# EAGLE design MainBoard (EAGLE 9.0.1)
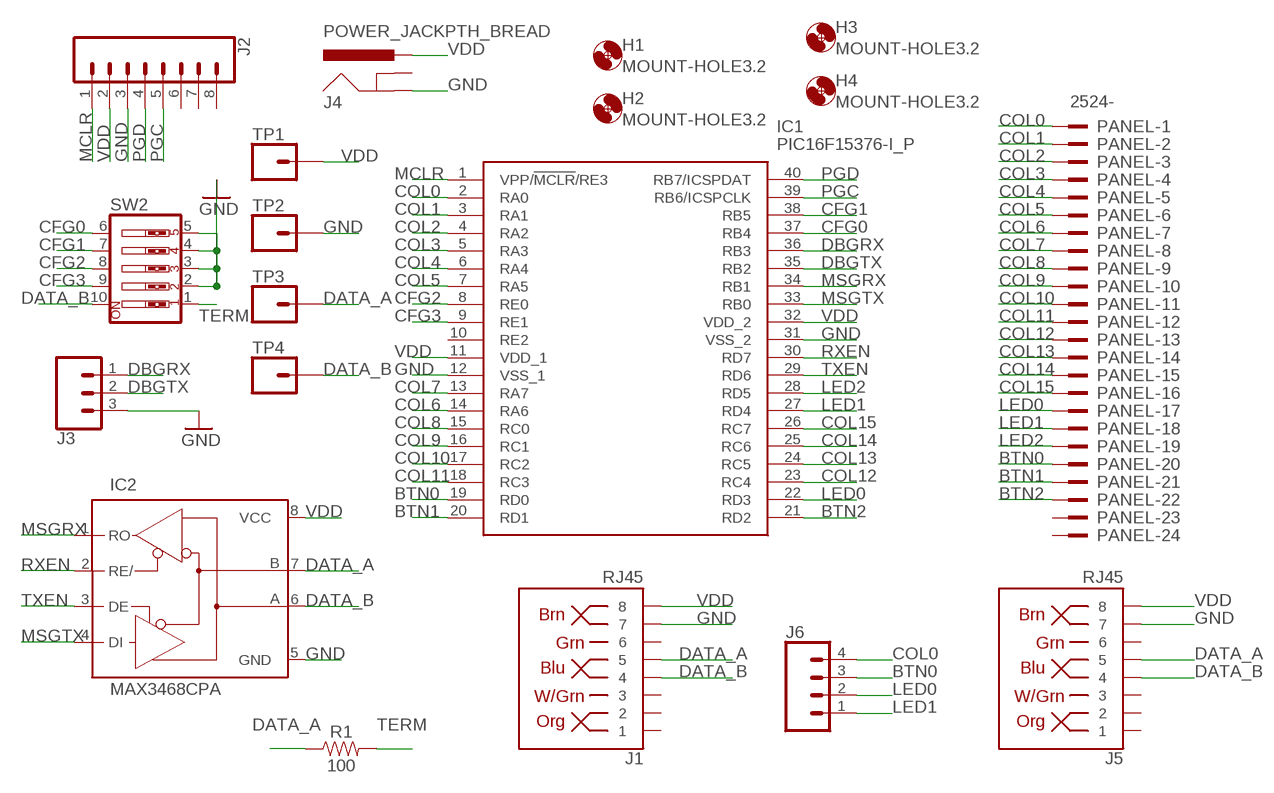
[diagram p0: schematic, sheet 1]

## Parts
H1  MOUNT-HOLE3.2  [3,2]
H2  MOUNT-HOLE3.2  [3,2]
H3  MOUNT-HOLE3.2  [3,2]
H4  MOUNT-HOLE3.2  [3,2]
IC1  PIC16F15376-I_P  [DIP1550W56P254L5219H483Q40N]
IC2  MAX3468CPA  [DIL08]
J1  RJ45  RJ45-8  [RJ45-8]
J2  CONN_08"  [1X08]
J3  CONN_03  [1X03]
J4  POWER_JACKPTH_BREAD  [POWER_JACK_PTH_BREAD]
J5  RJ45  RJ45-8  [RJ45-8]
J6  CONN_04  [1X04]
PANEL  2524-  [PAK100/2500-24]
R1  100  100OHM-HORIZ-1/4W-1%  [AXIAL-0.3]
SW2  SW_DIP-5  [EDG-05]
TP1  CONN_01  [1X01]
TP2  CONN_01  [1X01]
TP3  CONN_01  [1X01]
TP4  CONN_01  [1X01]

## Nets
BTN0: IC1.19(RD0) J6.3 PANEL.20
BTN1: IC1.20(RD1) PANEL.21
BTN2: IC1.21(RD2) PANEL.22
CFG0: IC1.37(RB4) SW2.6
CFG1: IC1.38(RB5) SW2.7
CFG2: IC1.8(RE0) SW2.8
CFG3: IC1.9(RE1) SW2.9
COL0: IC1.2(RA0) J6.4 PANEL.1
COL1: IC1.3(RA1) PANEL.2
COL2: IC1.4(RA2) PANEL.3
COL3: IC1.5(RA3) PANEL.4
COL4: IC1.6(RA4) PANEL.5
COL5: IC1.7(RA5) PANEL.6
COL6: IC1.14(RA6) PANEL.7
COL7: IC1.13(RA7) PANEL.8
COL8: IC1.15(RC0) PANEL.9
COL9: IC1.16(RC1) PANEL.10
COL10: IC1.17(RC2) PANEL.11
COL11: IC1.18(RC3) PANEL.12
COL12: IC1.23(RC4) PANEL.13
COL13: IC1.24(RC5) PANEL.14
COL14: IC1.25(RC6) PANEL.15
COL15: IC1.26(RC7) PANEL.16
DATA_A: IC2.7(B) J1.5 J5.5 R1.P$1 TP3.1
DATA_B: IC2.6(A) J1.4 J5.4 SW2.10 TP4.1
DBGRX: IC1.36(RB3) J3.1
DBGTX: IC1.35(RB2) J3.2
GND: IC1.12(VSS_1) IC1.31(VSS_2) IC2.5(GND) J1.7 J2.3 J3.3 J4.GND J5.7 SW2.2 SW2.3 SW2.4 SW2.5 TP2.1
LED0: IC1.22(RD3) J6.2 PANEL.17
LED1: IC1.27(RD4) J6.1 PANEL.18
LED2: IC1.28(RD5) PANEL.19
MCLR: IC1.1(VPP/!MCLR!/RE3) J2.1
MSGRX: IC1.34(RB1) IC2.1(RO)
MSGTX: IC1.33(RB0) IC2.4(DI)
PGC: IC1.39(RB6/ICSPCLK) J2.5
PGD: IC1.40(RB7/ICSPDAT) J2.4
RXEN: IC1.30(RD7) IC2.2(RE/)
TERM: R1.P$2 SW2.1
TXEN: IC1.29(RD6) IC2.3(DE)
VDD: IC1.11(VDD_1) IC1.32(VDD_2) IC2.8(VCC) J1.8 J2.2 J4.PWR J5.8 TP1.1
Unconnected: IC1.10(RE2) J1.1 J1.2 J1.3 J1.6 J2.6 J2.7 J2.8 J4.GNDBREAK J5.1 J5.2 J5.3 J5.6 PANEL.23 PANEL.24

## Library data of the parts
H1-H4 = holes:MOUNT-HOLE: MOUNTING HOLE with drill center marker
IC1 = SamacSys_Parts:PIC16F15376-I_P: MICROCHIP - PIC16F15376-I/P - 40 PDIP .600in TUBE , 28KB, 2KB RAM, 4xPWMs, Comparator, DAC, ADC, CWG, 4xCLC, 2 EUSART, SPI/I2C Source: Datasheet <http://ww1.microchip.com/downloads/en/DeviceDoc/PIC16LF15356-75-76-85-86-Data Sheet-40001866B.pdf>; DESCRIPTION: MICROCHIP - PIC16F15376-I/P - 40 PDIP .600in TUBE , 28KB, 2KB RAM, 4xPWMs, Comparator, DAC, ADC, CWG, 4xCLC, 2 EUSART, SPI/I2C; HEIGHT: 4.83mm; MANUFACTURER_NAME: Microchip; MANUFACTURER_PART_NUMBER: PIC16F15376-I/P
IC2 = maxim:MAX34*: +5V, Fail-Safe, 40Mbps, Profibus RS-485/RS-422 Transceivers Source: MAX3465-MAX3469.pdf; OC_FARNELL: unknown; OC_NEWARK: unknown
J1 J5 = SparkFun-Connectors:RJ45-8: RJ45 Jack - 8 pin Simple RJ45, 8-pin connection. Commonly used for Cat5, Cat5e, and Cat6 Ethernet cables. Here is the connector we sell at SparkFun: RJ45 8-Pin Connector <https://www.sparkfun.com/products/643> (PRT-00643) Datasheet <https://cdn.sparkfun.com/datasheets/Prototyping/04908.pdf> It is used on this SparkFun product: SparkFun RJ45 Breakout <https://www.sparkfun.com/products/716> (BOB-00716) Note, you may also be interested in the "MAGJACK" version of this. It is basically a RJ45 connector, but also has some status LEDs built into the connector housing. You can check that out in this library at the device named "MAGJACK.dev" and see these products online: RJ45 Ethernet MagJack-Compatible <https://www.sparkfun.com/products/8534> (PRT-08534) SparkFun RJ45 MagJack Breakout <https://www.sparkfun.com/products/13021> (BOB-13021); PROD_ID: CONN-08506; SF_ID: PRT-00643
J2 = SparkFun-Connectors:CONN_08: Multi connection point. Often used as Generic Header-pin footprint for 0.1 inch spaced/style header connections On any of the 0.1 inch spaced packages, you can populate with these: Break Away Headers - Straight <https://www.sparkfun.com/products/116> (PRT-00116) Break Away Male Headers - Right Angle <https://www.sparkfun.com/products/553> (PRT-00553) Female Headers <https://www.sparkfun.com/products/115> (PRT-00115) Break Away Headers - Machine Pin <https://www.sparkfun.com/products/117> (PRT-00117) Break Away Female Headers - Swiss Machine Pin <https://www.sparkfun.com/products/743> (PRT-00743) Arduino Stackable Header - 8 Pin <https://www.sparkfun.com/products/9279> (PRT-09279) For SCREWTERMINALS and SPRING TERMINALS visit here: Screw Terimnals on SparkFun.com <https://www.sparkfun.com/search/results?term=Screw+Terminals> (5mm/3.5mm/2.54mm spacing) This device is also useful as a general connection point to wire up your design to another part of your project. Our various solder wires solder well into these plated through hole pads. Hook-Up Wire - Assortment (Stranded, 22 AWG) <https://www.sparkfun.com/products/11375> (PRT-11375) Hook-Up Wire - Assortment (Solid Core, 22 AWG) <https://www.sparkfun.com/products/11367> (PRT-11367) View the entire wire category on our website here <https://www.sparkfun.com/categories/141> Special notes: Molex polarized connector foot print use with SKU : PRT-08231 with associated crimp pins and housings. 1MM SMD Version SKU: PRT-10208 NOTES ON THE VARIANTS LOCK and LOCK_LONGPADS... This footprint was designed to help hold the alignment of a through-hole component (i.e. 6-pin header) while soldering it into place. You may notice that each hole has been shifted either up or down by 0.005 of an inch from it's more standard position (which is a perfectly straight line). This slight alteration caused the pins (the squares in the middle) to touch the edges of the holes. Because they are alternating, it causes a "brace" to hold the component in place. 0.005 has proven to be the perfect amount of "off-center" position when using our standard breakaway headers. Although looks a little odd when you look at the bare footprint, once you have a header in there, the alteration is very hard to notice. Also,if you push a header all the way into place, it is covered up entirely on the bottom side.; PROD_ID: CONN-08438
J3 = SparkFun-Connectors:CONN_03: Multi connection point. Often used as Generic Header-pin footprint for 0.1 inch spaced/style header connections On any of the 0.1 inch spaced packages, you can populate with these: Break Away Headers - Straight <https://www.sparkfun.com/products/116> (PRT-00116) Break Away Male Headers - Right Angle <https://www.sparkfun.com/products/553> (PRT-00553) Female Headers <https://www.sparkfun.com/products/115> (PRT-00115) Break Away Headers - Machine Pin <https://www.sparkfun.com/products/117> (PRT-00117) Break Away Female Headers - Swiss Machine Pin <https://www.sparkfun.com/products/743> (PRT-00743) Stackable Header - 3 Pin (Female, 0.1") <https://www.sparkfun.com/products/13875> (PRT-13875) For SCREWTERMINALS and SPRING TERMINALS visit here: Screw Terimnals on SparkFun.com <https://www.sparkfun.com/search/results?term=Screw+Terminals> (5mm/3.5mm/2.54mm spacing) This device is also useful as a general connection point to wire up your design to another part of your project. Our various solder wires solder well into these plated through hole pads. Hook-Up Wire - Assortment (Stranded, 22 AWG) <https://www.sparkfun.com/products/11375> (PRT-11375) Hook-Up Wire - Assortment (Solid Core, 22 AWG) <https://www.sparkfun.com/products/11367> (PRT-11367) View the entire wire category on our website here <https://www.sparkfun.com/categories/141> Special notes: Molex polarized connector foot print use with SKU : PRT-08232 with associated crimp pins and housings.
J4 = SparkFun-Connectors:POWER_JACK: Power Jack Connector This is the standard 5.5mm barrel jack for power. The PTH is the most common, proven, reliable, footprint. The Slot footprint only works if the mill layer is transmitted to the PCB fab house so be warned. Here are the connectors we sell at SparkFun: DC Barrel Power Jack/Connector <https://www.sparkfun.com/products/119> (PRT-00119) DC Barrel Power Jack/Connector (SMD) <https://www.sparkfun.com/products/12748> (PRT-12748) DC Barrel Jack Adapter - Breadboard Compatible <https://www.sparkfun.com/products/10811> (PRT-10811) It is used on this SparkFun product (and many, many others): SparkFun RedBoard - Programmed with Arduino <https://www.sparkfun.com/products/12757> (DEV-12757) Also, if you need a mating power supply or connector, please check these out: Wall Adapter Power Supply - 9VDC 650mA <https://www.sparkfun.com/products/298> (TOL-00298) DC Barrel Jack Adapter - Male <https://www.sparkfun.com/products/10287> (PRT-10287); PROD_ID: PRT-10811
J6 = SparkFun-Connectors:CONN_04: Multi connection point. Often used as Generic Header-pin footprint for 0.1 inch spaced/style header connections On any of the 0.1 inch spaced packages, you can populate with these: Break Away Headers - Straight <https://www.sparkfun.com/products/116> (PRT-00116) Break Away Male Headers - Right Angle <https://www.sparkfun.com/products/553> (PRT-00553) Female Headers <https://www.sparkfun.com/products/115> (PRT-00115) Break Away Headers - Machine Pin <https://www.sparkfun.com/products/117> (PRT-00117) Break Away Female Headers - Swiss Machine Pin <https://www.sparkfun.com/products/743> (PRT-00743) For SCREWTERMINALS and SPRING TERMINALS visit here: Screw Terimnals on SparkFun.com <https://www.sparkfun.com/search/results?term=Screw+Terminals> (5mm/3.5mm/2.54mm spacing) This device is also useful as a general connection point to wire up your design to another part of your project. Our various solder wires solder well into these plated through hole pads. Hook-Up Wire - Assortment (Stranded, 22 AWG) <https://www.sparkfun.com/products/11375> (PRT-11375) Hook-Up Wire - Assortment (Solid Core, 22 AWG) <https://www.sparkfun.com/products/11367> (PRT-11367) View the entire wire category on our website here <https://www.sparkfun.com/categories/141> Special notes: Molex polarized connector foot print use with SKU : PRT-08231 with associated crimp pins and housings. 1MM SMD Version SKU: PRT-10208; PROD_ID: CONN-09696
PANEL = con-3m:2524-: 3M (TM) Pak 100 4-Wall Header Source: 3M; OC_FARNELL: unknown; OC_NEWARK: unknown
R1 = SparkFun-Resistors:100OHM: 100Ω resistor A resistor is a passive two-terminal electrical component that implements electrical resistance as a circuit element. Resistors act to reduce current flow, and, at the same time, act to lower voltage levels within circuits. - Wikipedia; PROD_ID: RES-12181
SW2 = special:SW_DIP-5: DIP SWITCH
TP1-TP4 = SparkFun-Connectors:CONN_01: Single connection point. Often used as Generic Header-pin footprint for 0.1 inch spaced/style header connections On any of the 0.1 inch spaced packages, you can populate with these: Break Away Headers - Straight <https://www.sparkfun.com/products/116> (PRT-00116) Break Away Male Headers - Right Angle <https://www.sparkfun.com/products/553> (PRT-00553) Female Headers <https://www.sparkfun.com/products/115> (PRT-00115) Break Away Headers - Machine Pin <https://www.sparkfun.com/products/117> (PRT-00117) Break Away Female Headers - Swiss Machine Pin <https://www.sparkfun.com/products/743> (PRT-00743) This device is also useful as a general connection point to wire up your design to another part of your project. Our various solder wires solder well into these plated through hole pads. Hook-Up Wire - Assortment (Stranded, 22 AWG) <https://www.sparkfun.com/products/11375> (PRT-11375) Hook-Up Wire - Assortment (Solid Core, 22 AWG) <https://www.sparkfun.com/products/11367> (PRT-11367) View the entire wire category on our website here <https://www.sparkfun.com/categories/141> Special notes: SMTSO-256-ET is a "flush mount" nut for a 4-40 screw. We mostly use this on specialty testbeds; it is a nice way to connect hardware to your PCB at an adjustable hieght. Also note, the SNAP packages are for using a snappable style connector. We sell a baggie of snaps and they are also used on two LilyPad designs: Snap Assortment - 30 pack (male and female) <https://www.sparkfun.com/products/11347> (DEV-11347) LilyPad Arduino SimpleSnap <https://www.sparkfun.com/products/10941> (DEV-10941) LilyPad SimpleSnap Protoboard <https://www.sparkfun.com/products/10940> (DEV-10940)

## Board
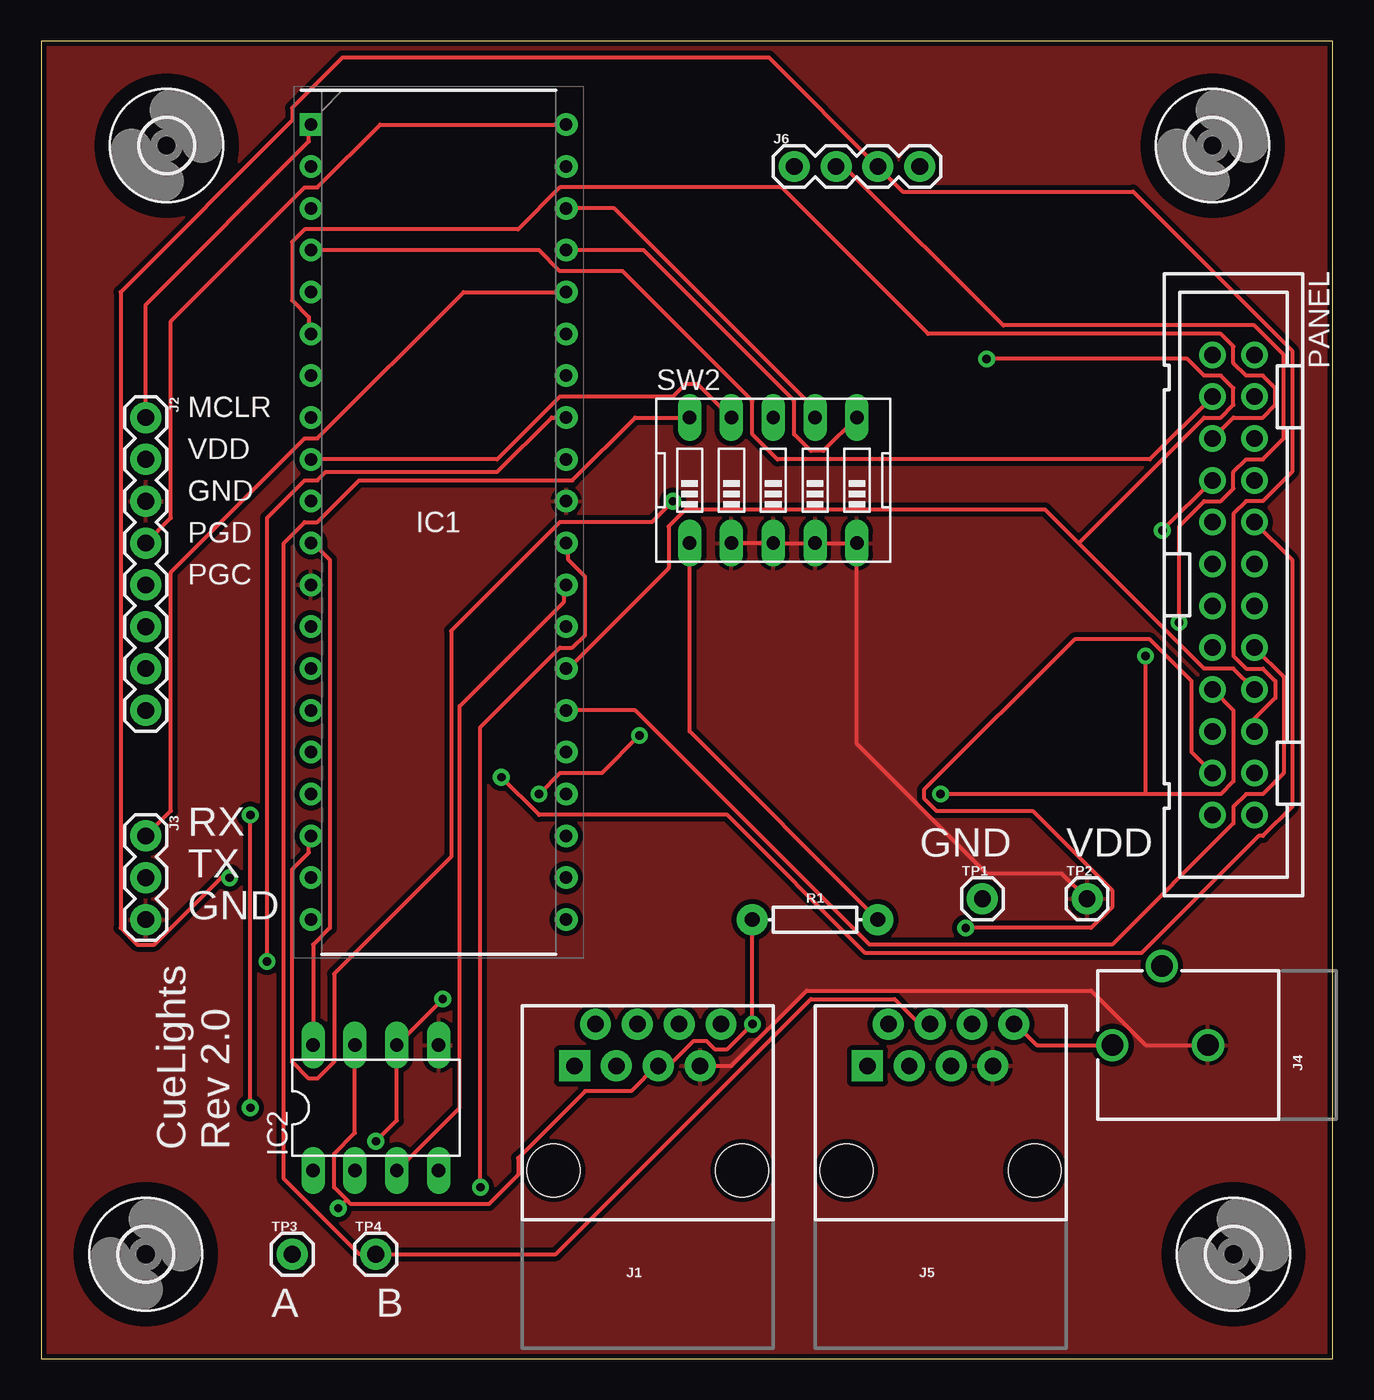
[diagram p1: board, top side]
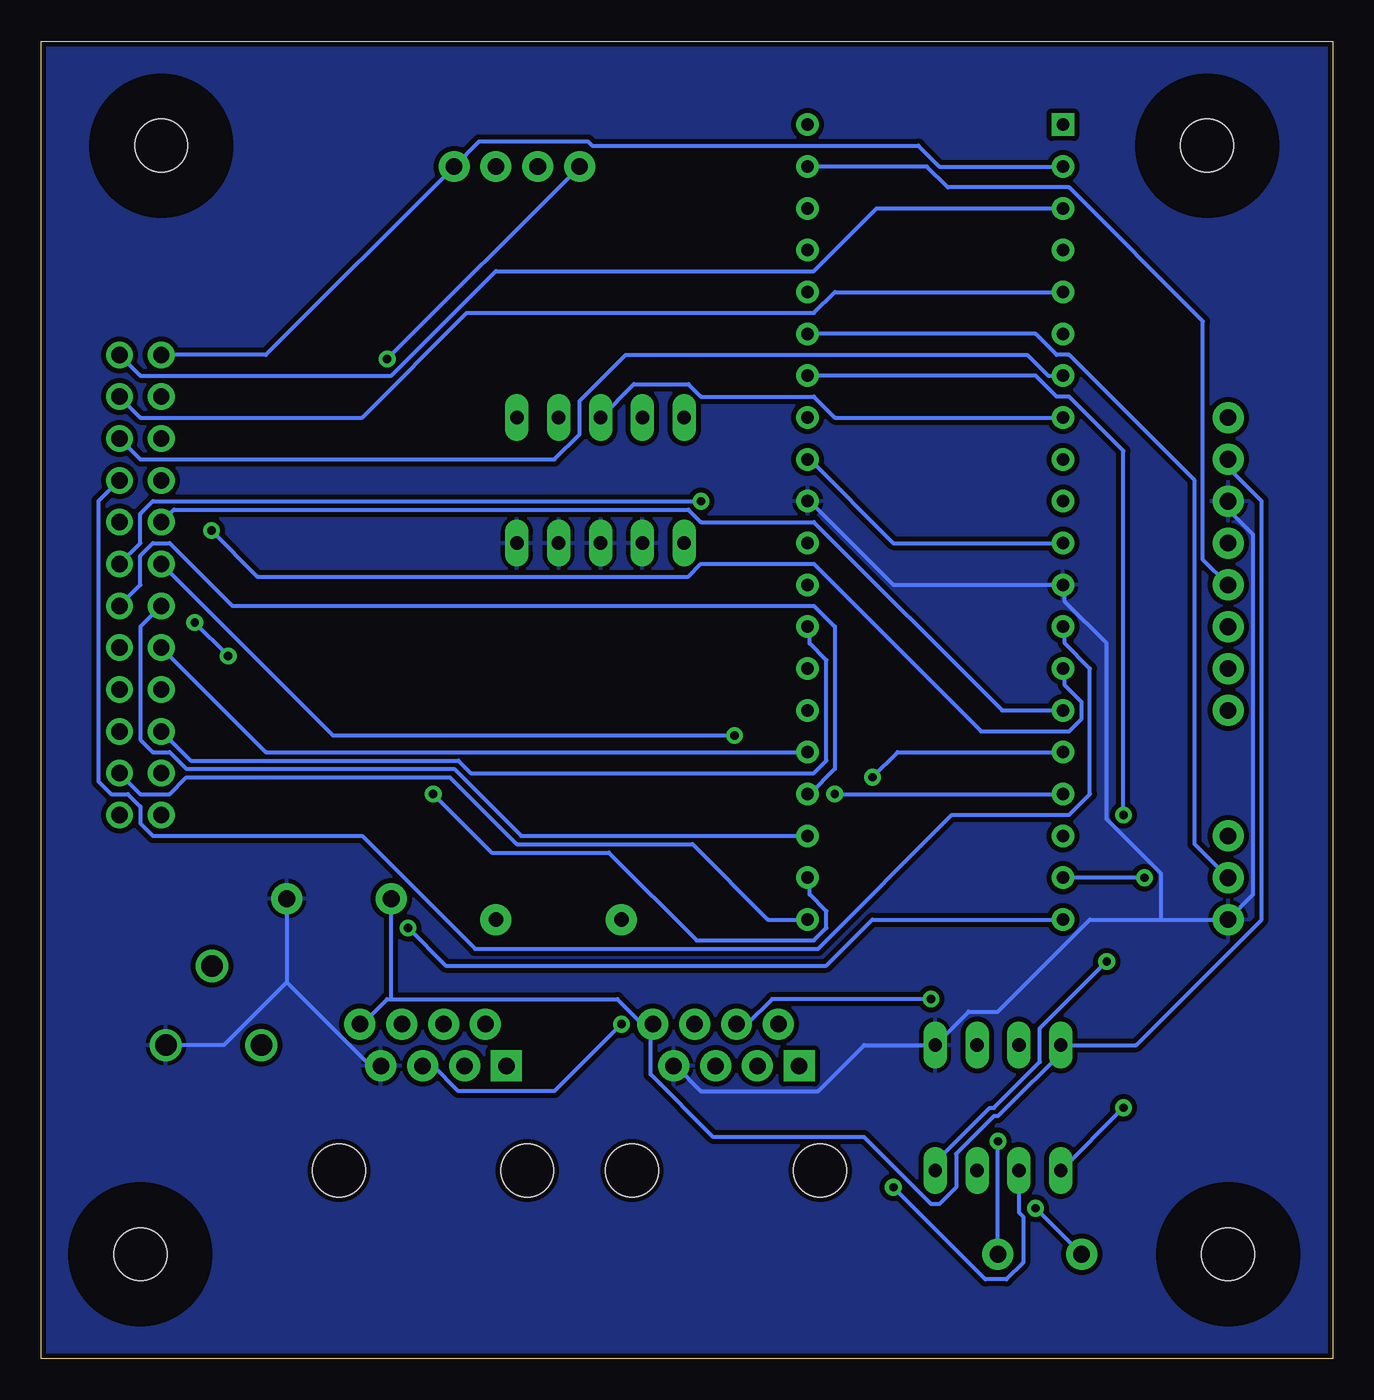
[diagram p2: board, bottom side, seen from below]

Size 78.41 x 80 mm. Coordinates in mm from the lower left corner, seen from the top.
Outline: 0,0 78.41,0 78.41,80 0,80 0,0
Copper layers (1*16): Top 0.035mm / dielectric 1.5mm / Bottom 0.035mm
Design rules "SparkFunIncreasedClearance": minimum track width 10mil, minimum drill 20mil, track to track 10mil, track to pad 10mil, pad to pad 10mil, via to via 10mil, smd to smd 8mil, copper to edge 10mil, drill to drill 10mil, minimum pad ring 12mil, minimum via ring 10mil, stop-mask expansion 4mil, vias tented up to drill 25mil, thermal gap 10mil

### Footprints (pad centres in the part's own frame; a part is rotated, then mirrored left to right if it is on the bottom)
3,2 = hole 3.2: 0,0
DIP1550W56P254L5219H483Q40N = drill 0.76 pad 1.16 square: 1 -7.748,24.13 | drill 0.76 pad 1.16: 2 -7.748,21.59; 3 -7.748,19.05; 4 -7.748,16.51; 5 -7.748,13.97; 6 -7.748,11.43; 7 -7.748,8.89; 8 -7.748,6.35; 9 -7.748,3.81; 10 -7.748,1.27; 11 -7.748,-1.27; 12 -7.748,-3.81; 13 -7.748,-6.35; 14 -7.748,-8.89; 15 -7.748,-11.43; 16 -7.748,-13.97; 17 -7.748,-16.51; 18 -7.748,-19.05; 19 -7.748,-21.59; 20 -7.748,-24.13; 21 7.748,-24.13; 22 7.748,-21.59; 23 7.748,-19.05; 24 7.748,-16.51; 25 7.748,-13.97; 26 7.748,-11.43; 27 7.748,-8.89; 28 7.748,-6.35; 29 7.748,-3.81; 30 7.748,-1.27; 31 7.748,1.27; 32 7.748,3.81; 33 7.748,6.35; 34 7.748,8.89; 35 7.748,11.43; 36 7.748,13.97; 37 7.748,16.51; 38 7.748,19.05; 39 7.748,21.59; 40 7.748,24.13
DIL08 = drill 0.813 long: 1 -3.81,-3.81; 2 -1.27,-3.81; 3 1.27,-3.81; 4 3.81,-3.81; 5 3.81,3.81; 6 1.27,3.81; 7 -1.27,3.81; 8 -3.81,3.81
RJ45-8 = drill 1 pad 1.88 square: 1 -4.445,6.35 | drill 1 pad 1.88: 2 -3.175,8.89; 3 -1.905,6.35; 4 -0.635,8.89; 5 0.635,6.35; 6 1.905,8.89; 7 3.175,6.35; 8 4.445,8.89 | hole 3.2: -5.715,0; 5.715,0
1X08 = drill 1.016 pad 1.88: 1 0,0; 2 2.54,0; 3 5.08,0; 4 7.62,0; 5 10.16,0; 6 12.7,0; 7 15.24,0; 8 17.78,0
1X03 = drill 1.016 pad 1.88: 1 0,0; 2 2.54,0; 3 5.08,0
POWER_JACK_PTH_BREAD = drill 1.3: GND 0,7.9; GNDBREAK 4.8,10.7; PWR 0,13.7
1X04 = drill 1.016 pad 1.88: 1 0,0; 2 2.54,0; 3 5.08,0; 4 7.62,0
PAK100/2500-24 = drill 1 pad 1.422: 1 -13.97,-1.27; 2 -13.97,1.27; 3 -11.43,-1.27; 4 -11.43,1.27; 5 -8.89,-1.27; 6 -8.89,1.27; 7 -6.35,-1.27; 8 -6.35,1.27; 9 -3.81,-1.27; 10 -3.81,1.27; 11 -1.27,-1.27; 12 -1.27,1.27; 13 1.27,-1.27; 14 1.27,1.27; 15 3.81,-1.27; 16 3.81,1.27; 17 6.35,-1.27; 18 6.35,1.27; 19 8.89,-1.27; 20 8.89,1.27; 21 11.43,-1.27; 22 11.43,1.27; 23 13.97,-1.27; 24 13.97,1.27
AXIAL-0.3 = drill 0.9 pad 1.88: P$1 -3.81,0; P$2 3.81,0
EDG-05 = drill 0.813 long: 1 -5.08,-3.81; 2 -2.54,-3.81; 3 0,-3.81; 4 2.54,-3.81; 5 5.08,-3.81; 6 5.08,3.81; 7 2.54,3.81; 8 0,3.81; 9 -2.54,3.81; 10 -5.08,3.81
1X01 = drill 1.016 pad 1.88: 1 0,0

### Placement (x,y rotation side)
H1  71.12,73.66 0 top
H2  72.39,6.35 0 top
H3  6.35,6.35 0 top
H4  7.62,73.66 0 top
IC1  24.13,50.8 0 top
IC2  20.32,15.24 0 top
J1  36.83,11.43 0 top
J2  6.35,57.15 270 top
J3  6.35,31.75 270 top
J4  78.74,19.05 90 top
J5  54.61,11.43 0 top
J6  45.72,72.39 0 top
PANEL  72.39,46.99 270 top
R1  46.99,26.67 0 top
SW2  44.45,53.34 0 top
TP1  57.15,27.94 0 top
TP2  63.5,27.94 0 top
TP3  15.24,6.35 0 top
TP4  20.32,6.35 0 top

### Tracks (layer width: path | path; a pad name or v marks a point on that pad's centre or on a via)
BTN0  (via drill 0.51)
  Top 0.254: v11.43,29.21 10.92,29.21 6.86,25.15 5.84,25.15 4.83,26.16 4.83,64.77 15.24,75.18 15.24,75.95 18.29,78.99 44.2,78.99 J6.3 52.32,70.87 66.29,70.87 75.95,61.21 75.95,53.85 74.17,52.07 73.15,52.07 72.39,51.31 72.39,42.67 73.15,41.91 74.17,41.91 74.93,41.15 74.93,40.13 73.66,38.86 PANEL.20
  Bottom 0.254: v11.43,29.21 IC1.19
BTN1  (via drill 0.51)
  Top 0.254: v56.13,26.16 63.75,26.16 65.02,27.43 65.02,28.45 60.2,33.27 54.36,33.27 53.59,34.04 53.59,34.54 62.74,43.69 67.31,43.69 69.85,41.15 69.85,36.83 PANEL.21
  Bottom 0.254: IC1.20 27.94,26.67 30.73,23.88 53.85,23.88 v56.13,26.16
BTN2
  Bottom 0.254: IC1.21 34.29,26.67 38.86,31.24 49.53,31.24 53.59,35.31 69.6,35.31 70.61,34.29 72.39,34.29 PANEL.22
CFG0
  Top 0.254: IC1.37 36.58,67.31 45.72,58.17 45.72,56.13 46.74,55.12 47.5,55.12 SW2.6
CFG1
  Top 0.254: IC1.38 34.8,69.85 46.99,57.66 SW2.7
CFG2
  Bottom 0.254: IC1.8 30.23,57.15 31.5,58.42 38.35,58.42 39.12,59.18 42.42,59.18 SW2.8
CFG3
  Top 0.254: IC1.9 27.69,54.61 31.5,58.42 38.35,58.42 39.12,59.18 39.88,59.18 SW2.9
COL0
  Bottom 0.254: IC1.2 23.88,72.39 25.15,73.66 44.96,73.66 45.21,73.91 51.82,73.91 J6.4 64.77,60.96 PANEL.1
COL1
  Bottom 0.254: IC1.3 27.69,69.85 31.5,66.04 50.8,66.04 57.15,59.69 72.39,59.69 PANEL.2
COL2
  Top 0.254: IC1.4 30.23,67.31 31.5,66.04 35.31,66.04 43.18,58.17 43.18,56.13 44.7,54.61 67.31,54.61 PANEL.3
COL3
  Bottom 0.254: IC1.5 30.23,64.77 31.5,63.5 52.58,63.5 58.93,57.15 72.39,57.15 PANEL.4
COL4
  Top 0.254: PANEL.5 72.39,57.15 74.17,57.15 74.93,57.91 74.93,58.93 74.17,59.69 73.15,59.69 72.39,60.45 72.39,61.47 71.63,62.23 53.85,62.23 44.96,71.12 31.5,71.12 28.96,68.58 16,68.58 15.24,67.82 15.24,64.26 16.26,63.25 16.26,62.23 IC1.6
COL5
  Bottom 0.254: IC1.7 17.27,59.69 18.54,60.96 42.93,60.96 45.72,58.17 45.72,56.13 47.24,54.61 72.39,54.61 PANEL.6
COL6  (via drill 0.51)
  Top 0.254: PANEL.7 v68.07,50.29
  Bottom 0.254: v68.07,50.29 65.28,47.5 39.12,47.5 38.35,48.26 31.5,48.26 21.34,38.1 16,38.1 15.24,38.86 15.24,39.88 16.26,40.89 16.26,41.91 IC1.14
COL7
  Bottom 0.254: PANEL.8 74.93,52.07 74.93,35.05 74.17,34.29 73.15,34.29 72.39,33.53 72.39,32.51 71.63,31.75 58.93,31.75 52.07,24.89 31.24,24.89 23.11,33.02 16,33.02 14.73,34.29 14.73,41.91 16.26,43.43 16.26,44.45 IC1.13
COL8
  Bottom 0.254: IC1.15 20.07,39.37 31.5,50.8 38.35,50.8 39.12,51.56 70.36,51.56 PANEL.9
COL9  (via drill 0.51)
  Top 0.254: v27.94,35.31 30.23,33.02 41.66,33.02 50.04,24.64 66.8,24.64 73.91,31.75 74.17,31.75 75.95,33.53 75.95,48.51 PANEL.10
  Bottom 0.254: IC1.16 26.42,36.83 v27.94,35.31
COL10  (via drill 0.51)
  Top 0.254: v30.23,34.29 31.5,35.56 34.04,35.56 v36.32,37.85
  Bottom 0.254: v30.23,34.29 IC1.17 | v36.32,37.85 60.71,37.85 PANEL.11
COL11  (via drill 0.51)
  Top 0.254: v38.35,52.07 37.08,50.8 31.5,50.8 24.89,44.2 24.89,30.48 17.78,23.37 17.78,18.03 16.76,17.02 16.26,17.02 15.24,18.03 15.24,29.72 16.26,30.73 16.26,31.75 IC1.18
  Bottom 0.254: v38.35,52.07 71.63,52.07 72.39,51.31 72.39,49.53 PANEL.12
COL12
  Bottom 0.254: IC1.23 49.28,31.75 53.34,35.81 69.6,35.81 70.61,36.83 71.63,36.83 72.39,37.59 72.39,44.45 PANEL.13
COL13
  Bottom 0.254: PANEL.14 72.39,46.99 72.39,48.77 71.63,49.53 70.61,49.53 66.8,45.72 31.5,45.72 30.23,44.45 30.23,35.81 31.75,34.29 IC1.24
COL14
  Bottom 0.254: IC1.25 64.77,36.83 PANEL.15
COL15
  Top 0.254: IC1.26 36.07,39.37 50.29,25.15 65.02,25.15 72.39,32.51 72.39,33.53 73.15,34.29 74.17,34.29 75.44,35.56 75.44,41.4 PANEL.16
DATA_A  (via drill 0.51)
  Top 0.254: IC2.7 19.05,13.72 17.78,12.45 17.78,10.41 18.54,9.65 | 18.54,9.65 18.8,9.4 27.18,9.4 28.96,11.18 28.96,12.19 33.02,16.26 35.81,16.26 37.34,17.78 J1.5 38.1,17.78 39.62,19.3 40.39,19.3 40.89,18.8 41.66,18.8 v43.18,20.32 R1.P$1 | 18.54,9.65 v18.03,9.14
  Bottom 0.254: v18.03,9.14 TP3.1 | J5.5 54.61,17.78 53.09,16.26 47.24,16.26 v43.18,20.32
DATA_B  (via drill 0.51)
  Top 0.254: v20.32,13.21 21.59,14.48 IC2.6 v24.38,21.84 | SW2.10 36.07,57.15 32.26,53.34 19.3,53.34 16.76,50.8 16,50.8 14.73,49.53 14.73,10.92 19.3,6.35 TP4.1 31.24,6.35 46.74,21.84 51.82,21.84 53.34,20.32 J5.4
  Bottom 0.254: TP4.1 v20.32,13.21 | J1.4 35.56,20.32 34.04,21.84 v24.38,21.84
DBGRX
  Top 0.254: IC1.36 25.65,64.77 16.76,55.88 16,55.88 7.87,47.75 7.87,33.27 J3.1
DBGTX
  Bottom 0.254: IC1.35 18.03,62.23 16.76,60.96 16,60.96 8.38,53.34 8.38,31.24 J3.2
GND
  Top 0.254: SW2.2 SW2.3 SW2.4 SW2.5 49.53,37.34 57.4,29.46 61.98,29.46 TP2.1 | J4.GND 67.06,19.05 63.75,22.35 46.48,22.35 41.91,17.78 J1.7
  Bottom 0.254: J5.7 58.42,17.78 63.5,22.86 | TP2.1 63.5,22.86 | J4.GND 67.31,19.05 63.5,22.86 | IC1.31 31.75,52.07 26.67,46.99 IC1.12 16.26,46.99 16.26,45.97 13.72,43.43 13.72,32.77 10.41,29.46 10.41,26.67 | J1.7 39.88,17.78 38.35,16.26 31.24,16.26 28.45,19.05 IC2.5 22.1,21.08 20.32,21.08 14.73,26.67 10.41,26.67 | 10.41,26.67 J3.3 4.83,28.19 4.83,50.04 6.35,51.56 J2.3
  pour Top (isolate 0.305): 0,0 0,80.01 78.74,80.01 78.74,0
  pour Bottom (isolate 0.305): 0,0 0,80.01 78.74,80.01 78.74,0
LED0  (via drill 0.51)
  Top 0.254: 67.06,34.29 71.63,34.29 72.39,35.05 72.39,39.37 PANEL.17 | 67.06,34.29 v54.61,34.29 | J6.2 48.77,72.39 58.42,62.74 73.66,62.74 75.44,60.96 75.44,55.88 74.17,54.61 73.15,54.61 72.39,53.85 72.39,52.83 71.63,52.07 70.61,52.07 69.09,50.55 v69.09,44.7 | 67.06,34.29 v67.06,42.67
  Bottom 0.254: v54.61,34.29 51.05,30.73 43.94,30.73 38.61,25.4 31.5,25.4 30.73,26.16 30.73,27.18 31.75,28.19 31.75,29.21 IC1.22 | v67.06,42.67 v69.09,44.7
LED1  (via drill 0.51)
  Top 0.254: 62.99,49.53 70.61,41.91 72.39,41.91 PANEL.18 | 62.99,49.53 60.96,51.56 39.12,51.56 38.1,50.55 38.1,48.01 32,41.91 IC1.27 | v57.4,60.71 69.6,60.71 70.61,59.69 71.63,59.69 72.39,58.93 72.39,57.91 71.63,57.15 70.61,57.15 62.99,49.53
  Bottom 0.254: v57.4,60.71 J6.1
LED2
  Bottom 0.254: PANEL.19 69.34,36.32 53.09,36.32 52.32,35.56 31.5,35.56 30.73,36.32 30.73,42.42 31.75,43.43 31.75,44.45 IC1.28
MCLR
  Top 0.254: J2.1 6.35,64.01 16.26,73.91 16.26,74.93 IC1.1
MSGRX  (via drill 0.51)
  Top 0.254: v12.7,15.24 v12.7,33.02
  Bottom 0.254: IC1.34 18.03,59.69 16.76,58.42 16,58.42 12.7,55.12 v12.7,33.02 | IC2.1 v12.7,15.24
MSGTX  (via drill 0.51)
  Top 0.254: IC1.33 30.99,57.15 27.69,53.85 17.27,53.85 16.76,53.34 16,53.34 13.72,51.05 v13.72,24.13
  Bottom 0.254: v13.72,24.13 17.78,20.07 17.78,18.03 20.57,15.24 20.83,15.24 24.13,11.94 IC2.4
PGC
  Bottom 0.254: IC1.39 24.64,72.39 23.37,71.12 16,71.12 7.87,62.99 7.87,48.51 J2.5
PGD
  Top 0.254: IC1.40 20.57,74.93 16.76,71.12 16,71.12 7.87,62.99 7.87,51.05 J2.4
RXEN  (via drill 0.51)
  Top 0.254: v26.67,10.41 26.67,38.35 31.5,43.18 32.26,43.18 33.02,43.94 33.02,47.5 32,48.51 32,49.53 IC1.30
  Bottom 0.254: v26.67,10.41 21.08,4.83 19.81,4.83 18.8,5.84 18.8,8.64 19.05,8.89 IC2.2
TERM
  Top 0.254: SW2.1 39.37,38.1 R1.P$2
TXEN
  Top 0.254: IC2.3 25.4,15.24 25.4,39.62 31.75,45.97 31.75,46.99 IC1.29
VDD
  Top 0.254: J4.PWR 60.45,19.05 59.18,20.32 J5.8 | IC2.8 16.51,25.15 17.53,26.16 17.53,48.51 16.51,49.53 IC1.11
  Bottom 0.254: 41.4,20.32 41.91,20.32 43.43,21.84 57.15,21.84 | 57.15,21.84 57.4,21.84 58.93,20.32 J5.8 | 57.15,21.84 TP1.1 | IC1.11 26.67,49.53 31.75,54.61 IC1.32 | J2.2 6.35,54.1 4.32,52.07 4.32,26.67 11.94,19.05 16,19.05 | 41.4,20.32 41.4,17.27 37.59,13.46 28.45,13.46 24.38,9.4 23.88,9.4 22.86,10.41 22.86,12.45 20.57,14.73 20.32,14.73 16,19.05 | 41.4,20.32 J1.8 | 16,19.05 IC2.8

### Text on the board
tPlace: MCLR | VDD | GND | PGD | PGC | RX | GND | VDD | TX | GND | CueLights / Rev 2.0 | A | B